# Altium schematic sheet voltage_divider.SchDoc
size A4; SheetNumber: 6; SheetTotal: 8
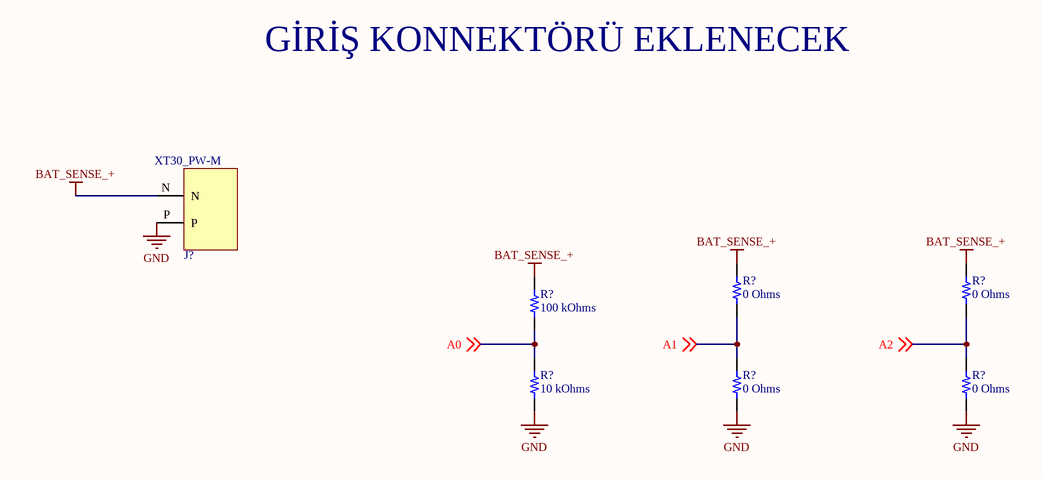
[diagram p0: voltage_divider.SchDoc]

## Parts
(Parts that share a designator on the sheet are numbered #1, #2 ... from top to bottom, then left to right.)
J?  XT30_PW-M  [XT30_PW-M]
R?#1  0 Ohms  [YAGEO RES RK73 RS73 SG73 0805_2012]
R?#2  0 Ohms  [RES 1206_3216]
R?#3  100 kOhms  [RES 0805_2012]
R?#4  10 kOhms  [RES 0805_2012]
R?#5  0 Ohms  [YAGEO RES RK73 RS73 SG73 0805_2012]
R?#6  0 Ohms  [RES 1206_3216]

## Nets
BAT_SENSE_+: J?.N R?#1.2 R?#2.2 R?#3.2
GND: J?.P R?#4.1 R?#5.1 R?#6.1
A0: R?#3.1 R?#4.2 ; off-sheet A0
A1: R?#1.1 R?#5.2 ; off-sheet A1
A2: R?#2.1 R?#6.2 ; off-sheet A2

## Notes on the sheet
- GİRİŞ KONNEKTÖRÜ EKLENECEK

## Library data of the parts
R?#1 R?#5 = RK73Z2ATTED: RESISTOR; Manufacturer: KOA Speer Electronics, Inc.; Tolerance: Jumper; Part Number: RK73Z2ATTED; Value: 0 Ohms; ComponentLink1Description: Datasheet; ComponentLink1URL: https://www.koaspeer.com/pdfs/RK73Z.pdf; ComponentLink2Description: DigiKey Link; ComponentLink2URL: https://www.digikey.com/en/products/detail/koa-speer-electronics-inc/RK73Z2ATTED/21679892; Composition: Thick Film; Device Package: 0805 (2012 Metric); Features: Automotive AEC-Q200; Height - Seated (Max): 0.024" (0.60mm); LastUpdated: 25.07.2024 09:45:07; Lifecycle Status: Active; Minimum Order: 1; Number of Terminations: 2; Operating Temperature: -55°C ~ 155°C; Package / Case: 0805 (2012 Metric); Packaging: TapeAndReel; PartId: 90035; Price: 0.01; Ratings: AEC-Q200; Resistance: 0 Ohms; Series: RK73Z; Size / Dimension: 0.079" L x 0.049" W (2.00mm x 1.25mm); Supplier 1: DigiKey; Supplier Part Number 1: 2019-RK73Z2ATTEDCT-ND; Supplier Device Package: 0805
R?#2 R?#6 = CRG1206ZR: RES SMD 0 OHM JUMPER 1/4W 1206; Manufacturer: TE Connectivity Passive Product; Power (Watts): 0.25W, 1/4W; Part Number: CRG1206ZR; ComponentLink1Description: Datasheet; ComponentLink1URL: https://www.te.com/commerce/DocumentDelivery/DDEController?Action=srchrtrv&DocNm=1773204&DocType=DS&DocLang=English; ComponentLink2Description: DigiKey Link; ComponentLink2URL: https://www.digikey.com/en/products/detail/te-connectivity-passive-product/CRG1206ZR/2055692; Composition: Thick Film; Device Package: 1206 (3216 Metric); Height - Seated (Max): 0.026" (0.65mm); LastUpdated: 9.02.2024 20:54:45; Lifecycle Status: Active; Minimum Order: 1; Number of Terminations: 2; Operating Temperature: -55°C ~ 155°C; Package / Case: 1206 (3216 Metric); Packaging: TapeAndReel; PartId: 26975; Part Status: Active; Price: 0.01; Resistance: 0 Ohms; Series: CRG, Neohm; Size / Dimension: 0.122" L x 0.061" W (3.10mm x 1.55mm); Supplier 1: DigiKey; Supplier Part Number 1: A106079CT-ND; Supplier Device Package: 1206; Tolerance: Jumper; Value: 0 Ohms
R?#3 = TNPW0805100KFEEA: RES 100K OHM 1% 1/8W 0805; Manufacturer: Vishay Dale; Power (Watts): 0.125W, 1/8W; Temperature Coefficient: ±25ppm/°C; Part Number: TNPW0805100KFEEA; Value: 100 kOhms; ComponentLink1Description: Datasheet; ComponentLink1URL: http://www.vishay.com/docs/28758/tnpw_e3.pdf; ComponentLink2Description: DigiKey Link; ComponentLink2URL: https://www.digikey.com/en/products/detail/vishay-dale/TNPW0805100KFEEA/7354887; Composition: Thin Film; Device Package: 0805 (2012 Metric); Features: Anti-Sulfur, Automotive AEC-Q200, Moisture Resistant; Height - Seated (Max): 0.022" (0.55mm); LastUpdated: 8.02.2024 21:02:09; Lifecycle Status: Active; Minimum Order: 1; Number of Terminations: 2; Operating Temperature: -55°C ~ 155°C; Package / Case: 0805 (2012 Metric); Packaging: TapeAndReel; PartId: 34552; Part Status: Active; Price: 0.06; Ratings: AEC-Q200; Resistance: 100 kOhms; Series: TNPW e3; Size / Dimension: 0.079" L x 0.049" W (2.00mm x 1.25mm); Supplier 1: DigiKey; Supplier Part Number 1: 541-3912-1-ND; Supplier Device Package: 0805; Tolerance: ±1%; JLCPCB Part Number: C25611
R?#4 = Y162410K0000T9R: RES SMD 10K OHM 0.01% 1/5W 0805; Manufacturer: Vishay Foil Resistors (Division of Vishay Precision Group); Power (Watts): 0.2W, 1/5W; Temperature Coefficient: ±0.2ppm/°C; Part Number: Y162410K0000T9R; Value: 10 kOhms; ComponentLink1Description: Datasheet; ComponentLink1URL: http://www.vishaypg.com/docs/63060/VSMP.pdf; ComponentLink2Description: DigiKey Link; ComponentLink2URL: https://www.digikey.com/en/products/detail/vishay-foil-resistors-division-of-vishay-precision-group/Y162410K0000T9R/1888101; Composition: Metal Foil; Device Package: 0805 (2012 Metric); Features: Moisture Resistant, Non-Inductive; Height - Seated (Max): 0.025" (0.64mm); LastUpdated: 8.02.2024 21:00:56; Lifecycle Status: Active; Minimum Order: 1; Number of Terminations: 2; Operating Temperature: -55°C ~ 150°C; Package / Case: 0805 (2012 Metric); Packaging: TapeAndReel; PartId: 48767; Part Status: Active; Price: 8.64; Resistance: 10 kOhms; Series: VSMP; Size / Dimension: 0.080" L x 0.050" W (2.03mm x 1.27mm); Supplier 1: DigiKey; Supplier Part Number 1: Y1624-10KCT-ND; Supplier Device Package: 0805; Tolerance: ±0.01%; JLCPCB Part Number: C17414